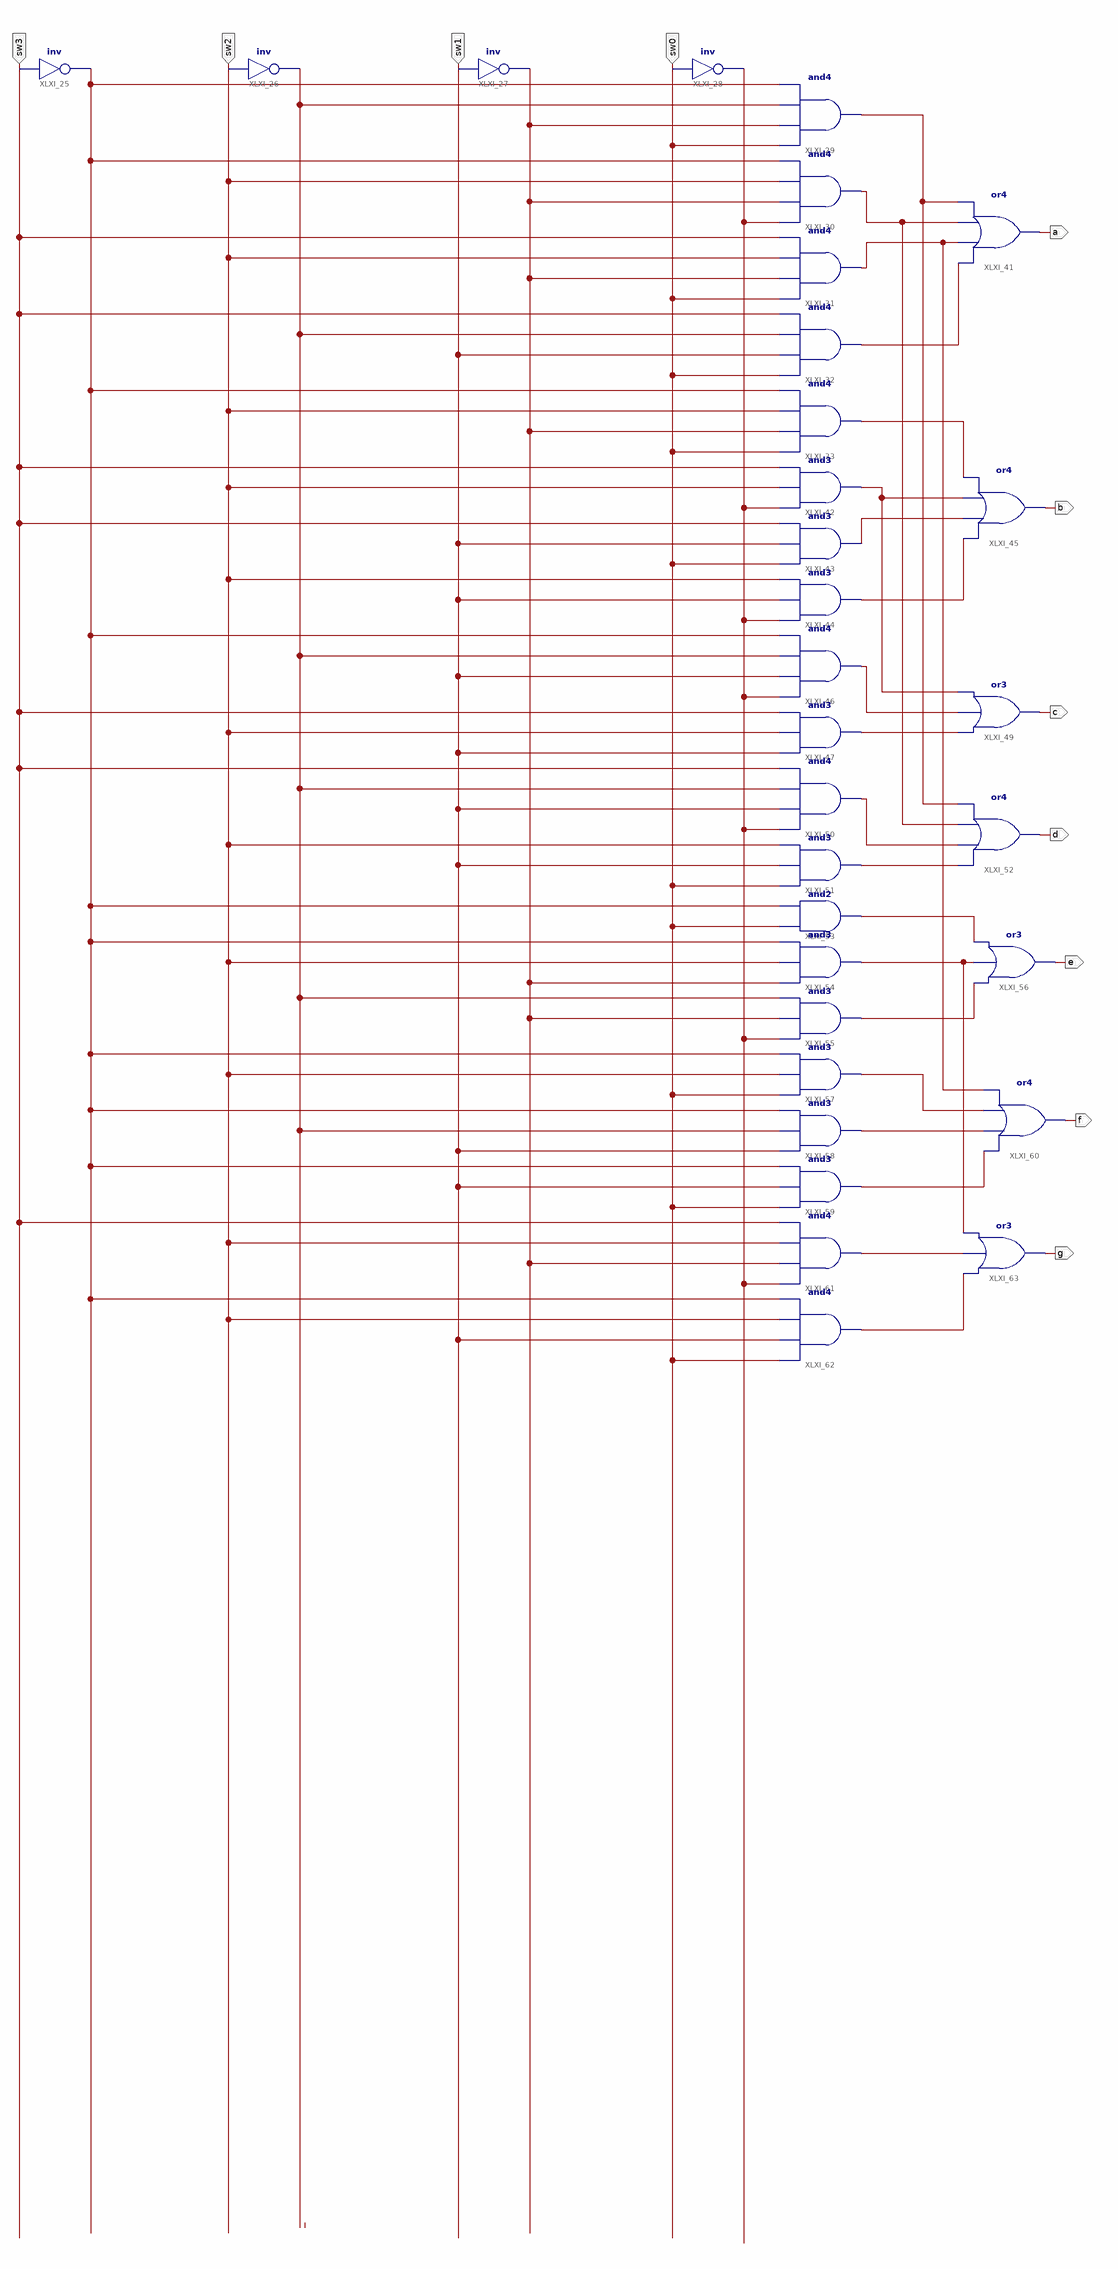
[diagram p0: schematic sheet 1]
// Xilinx ISE schematic BCD_to_7seg.sch (spartan3e) as structural Verilog: 31 symbols, 11 ports
module BCD_to_7seg (
  input  sw3,
  input  sw0,
  input  sw1,
  input  sw2,
  output a,
  output b,
  output c,
  output d,
  output e,
  output f,
  output g
);

  wire XLXN_117, XLXN_119, XLXN_123, XLXN_124, XLXN_130, XLXN_140, XLXN_142, XLXN_143, XLXN_144, XLXN_145,
       XLXN_146, XLXN_148, XLXN_149, XLXN_150, XLXN_152, XLXN_160, XLXN_162, XLXN_163, XLXN_164, XLXN_165,
       XLXN_166, XLXN_177, XLXN_178, XLXN_179;

  not XLXI_25 (XLXN_117, sw3);
  not XLXI_26 (XLXN_119, sw2);
  not XLXI_27 (XLXN_123, sw1);
  not XLXI_28 (XLXN_124, sw0);
  and XLXI_29 (XLXN_152, sw0, XLXN_123, XLXN_119, XLXN_117);
  and XLXI_30 (XLXN_150, XLXN_124, XLXN_123, sw2, XLXN_117);
  and XLXI_31 (XLXN_166, sw0, XLXN_123, sw2, sw3);
  and XLXI_32 (XLXN_130, sw0, sw1, XLXN_119, sw3);
  and XLXI_33 (XLXN_140, sw0, XLXN_123, sw2, XLXN_117);
  or XLXI_41 (a, XLXN_130, XLXN_166, XLXN_150, XLXN_152);
  and XLXI_42 (XLXN_144, XLXN_124, sw2, sw3);
  and XLXI_43 (XLXN_142, sw0, sw1, sw3);
  and XLXI_44 (XLXN_143, XLXN_124, sw1, sw2);
  or XLXI_45 (b, XLXN_143, XLXN_142, XLXN_144, XLXN_140);
  and XLXI_46 (XLXN_145, XLXN_124, sw1, XLXN_119, XLXN_117);
  and XLXI_47 (XLXN_146, sw1, sw2, sw3);
  or XLXI_49 (c, XLXN_146, XLXN_145, XLXN_144);
  and XLXI_50 (XLXN_149, XLXN_124, sw1, XLXN_119, sw3);
  and XLXI_51 (XLXN_148, sw0, sw1, sw2);
  or XLXI_52 (d, XLXN_148, XLXN_149, XLXN_150, XLXN_152);
  and XLXI_53 (XLXN_160, sw0, XLXN_117);
  and XLXI_54 (XLXN_177, XLXN_123, sw2, XLXN_117);
  and XLXI_55 (XLXN_162, XLXN_124, XLXN_123, XLXN_119);
  or XLXI_56 (e, XLXN_162, XLXN_177, XLXN_160);
  and XLXI_57 (XLXN_165, sw0, sw2, XLXN_117);
  and XLXI_58 (XLXN_164, sw1, XLXN_119, XLXN_117);
  and XLXI_59 (XLXN_163, sw0, sw1, XLXN_117);
  or XLXI_60 (f, XLXN_163, XLXN_164, XLXN_165, XLXN_166);
  and XLXI_61 (XLXN_178, XLXN_124, XLXN_123, sw2, sw3);
  and XLXI_62 (XLXN_179, sw0, sw1, sw2, XLXN_117);
  or XLXI_63 (g, XLXN_179, XLXN_178, XLXN_177);
endmodule
